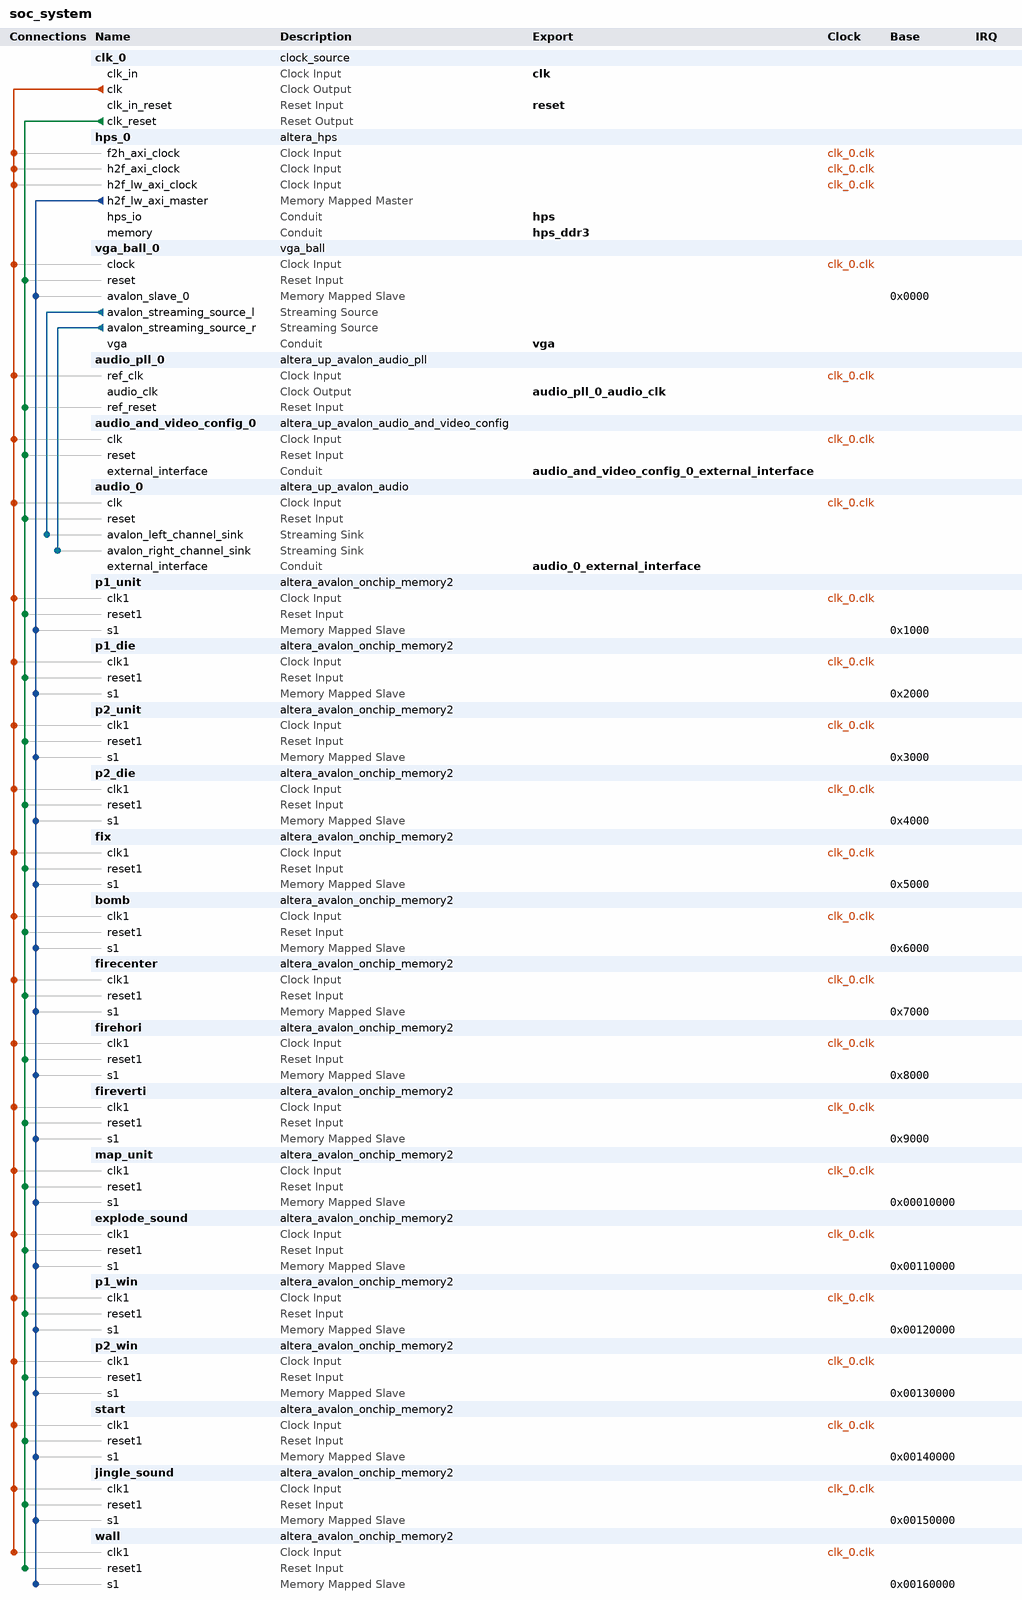
[diagram p0: system contents]
# Platform Designer (Qsys) system soc_system, Cyclone V 5CSEMA5F31C6
# Parameters at their usual value, and those the tool derives, are not listed.
package require -exact qsys 21.1
create_system soc_system
set_project_property DEVICE_FAMILY {Cyclone V}
set_project_property DEVICE 5CSEMA5F31C6

add_instance clk_0 clock_source 21.1
set_instance_parameter_value clk_0 clockFrequency 50000000

add_instance hps_0 altera_hps 21.1
set_instance_parameter_value hps_0 EMAC1_Mode RGMII
set_instance_parameter_value hps_0 EMAC1_PinMuxing {HPS I/O Set 0}
set_instance_parameter_value hps_0 F2SCLK_COLDRST_Enable false
set_instance_parameter_value hps_0 F2SCLK_DBGRST_Enable false
set_instance_parameter_value hps_0 F2SCLK_WARMRST_Enable false
set_instance_parameter_value hps_0 F2SINTERRUPT_Enable true
set_instance_parameter_value hps_0 F2S_Width 2
set_instance_parameter_value hps_0 FPGA_PERIPHERAL_OUTPUT_CLOCK_FREQ_EMAC0_GTX_CLK 125
set_instance_parameter_value hps_0 FPGA_PERIPHERAL_OUTPUT_CLOCK_FREQ_EMAC0_MD_CLK 2.5
set_instance_parameter_value hps_0 FPGA_PERIPHERAL_OUTPUT_CLOCK_FREQ_EMAC1_GTX_CLK 125
set_instance_parameter_value hps_0 FPGA_PERIPHERAL_OUTPUT_CLOCK_FREQ_EMAC1_MD_CLK 2.5
set_instance_parameter_value hps_0 HPS_PROTOCOL DDR3
set_instance_parameter_value hps_0 I2C0_Mode I2C
set_instance_parameter_value hps_0 I2C0_PinMuxing {HPS I/O Set 0}
set_instance_parameter_value hps_0 I2C1_Mode I2C
set_instance_parameter_value hps_0 I2C1_PinMuxing {HPS I/O Set 0}
set_instance_parameter_value hps_0 LWH2F_Enable true
set_instance_parameter_value hps_0 MEM_BANKADDR_WIDTH 3
set_instance_parameter_value hps_0 MEM_CLK_FREQ 400.0
set_instance_parameter_value hps_0 MEM_COL_ADDR_WIDTH 10
set_instance_parameter_value hps_0 MEM_DQ_WIDTH 32
set_instance_parameter_value hps_0 MEM_DRV_STR RZQ/7
set_instance_parameter_value hps_0 MEM_ROW_ADDR_WIDTH 15
set_instance_parameter_value hps_0 MEM_RTT_NOM RZQ/4
set_instance_parameter_value hps_0 MEM_RTT_WR RZQ/4
set_instance_parameter_value hps_0 MEM_TCL 11
set_instance_parameter_value hps_0 MEM_TFAW_NS 30.0
set_instance_parameter_value hps_0 MEM_TRAS_NS 35.0
set_instance_parameter_value hps_0 MEM_TRCD_NS 13.75
set_instance_parameter_value hps_0 MEM_TRFC_NS 260.0
set_instance_parameter_value hps_0 MEM_TRP_NS 13.75
set_instance_parameter_value hps_0 MEM_TRRD_NS 7.7
set_instance_parameter_value hps_0 MEM_VENDOR JEDEC
set_instance_parameter_value hps_0 MEM_WTCL 8
set_instance_parameter_value hps_0 QSPI_Mode N/A
set_instance_parameter_value hps_0 QSPI_PinMuxing Unused
set_instance_parameter_value hps_0 REF_CLK_FREQ 25.0
set_instance_parameter_value hps_0 S2FCLK_USER1CLK_Enable true
set_instance_parameter_value hps_0 S2FCLK_USER1CLK_FREQ 50.0
set_instance_parameter_value hps_0 S2FCLK_USER2CLK 5
set_instance_parameter_value hps_0 S2F_Width 2
set_instance_parameter_value hps_0 SDIO_Mode {4-bit Data}
set_instance_parameter_value hps_0 SDIO_PinMuxing {HPS I/O Set 0}
set_instance_parameter_value hps_0 SPIM1_Mode {Single Slave Select}
set_instance_parameter_value hps_0 SPIM1_PinMuxing {HPS I/O Set 0}
set_instance_parameter_value hps_0 STM_Enable false
set_instance_parameter_value hps_0 TIMING_BOARD_AC_SKEW 0.03
set_instance_parameter_value hps_0 TIMING_BOARD_AC_TO_CK_SKEW 0.0
set_instance_parameter_value hps_0 TIMING_BOARD_DQ_TO_DQS_SKEW 0.0
set_instance_parameter_value hps_0 TIMING_BOARD_MAX_CK_DELAY 0.03
set_instance_parameter_value hps_0 TIMING_BOARD_MAX_DQS_DELAY 0.02
set_instance_parameter_value hps_0 TIMING_BOARD_SKEW_BETWEEN_DQS 0.08
set_instance_parameter_value hps_0 TIMING_BOARD_SKEW_CKDQS_DIMM_MAX 0.16
set_instance_parameter_value hps_0 TIMING_BOARD_SKEW_CKDQS_DIMM_MIN 0.09
set_instance_parameter_value hps_0 TIMING_BOARD_SKEW_WITHIN_DQS 0.01
set_instance_parameter_value hps_0 TIMING_TDH 65
set_instance_parameter_value hps_0 TIMING_TDQSCK 255
set_instance_parameter_value hps_0 TIMING_TDQSQ 125
set_instance_parameter_value hps_0 TIMING_TDS 30
set_instance_parameter_value hps_0 TIMING_TIH 140
set_instance_parameter_value hps_0 TIMING_TIS 180
set_instance_parameter_value hps_0 TIMING_TQSH 0.4
set_instance_parameter_value hps_0 UART0_Mode {No Flow Control}
set_instance_parameter_value hps_0 UART0_PinMuxing {HPS I/O Set 0}
set_instance_parameter_value hps_0 USB1_Mode SDR
set_instance_parameter_value hps_0 USB1_PinMuxing {HPS I/O Set 0}
set_instance_parameter_value hps_0 desired_cfg_clk_mhz 50.0
set_instance_parameter_value hps_0 desired_qspi_clk_mhz 400.0

add_instance vga_ball_0 vga_ball 1.0

add_instance audio_pll_0 altera_up_avalon_audio_pll 18.0
set_instance_parameter_value audio_pll_0 gui_refclk 50.0

add_instance audio_and_video_config_0 altera_up_avalon_audio_and_video_config 18.0
set_instance_parameter_value audio_and_video_config_0 audio_in {Microphone to ADC}
set_instance_parameter_value audio_and_video_config_0 bit_length 16
set_instance_parameter_value audio_and_video_config_0 board DE1-SoC
set_instance_parameter_value audio_and_video_config_0 line_in_bypass true
set_instance_parameter_value audio_and_video_config_0 sampling_rate {48 kHz}

add_instance audio_0 altera_up_avalon_audio 18.0
set_instance_parameter_value audio_0 audio_in true
set_instance_parameter_value audio_0 avalon_bus_type Streaming
set_instance_parameter_value audio_0 dw 16

add_instance p1_unit altera_avalon_onchip_memory2 21.1
set_instance_parameter_value p1_unit dataWidth 16
set_instance_parameter_value p1_unit dualPort false
set_instance_parameter_value p1_unit initMemContent true
set_instance_parameter_value p1_unit initializationFileName /user/stud/fall23/ym3000/EE4840/project-hw/16bit_mif/p1.mif
set_instance_parameter_value p1_unit memorySize 2048
set_instance_parameter_value p1_unit useNonDefaultInitFile true
set_instance_parameter_value p1_unit writable false

add_instance p1_die altera_avalon_onchip_memory2 21.1
set_instance_parameter_value p1_die dataWidth 16
set_instance_parameter_value p1_die dualPort false
set_instance_parameter_value p1_die initMemContent true
set_instance_parameter_value p1_die initializationFileName /user/stud/fall23/ym3000/EE4840/project-hw/16bit_mif/p1die.mif
set_instance_parameter_value p1_die memorySize 512
set_instance_parameter_value p1_die useNonDefaultInitFile true
set_instance_parameter_value p1_die writable false

add_instance p2_unit altera_avalon_onchip_memory2 21.1
set_instance_parameter_value p2_unit dataWidth 16
set_instance_parameter_value p2_unit dualPort false
set_instance_parameter_value p2_unit initMemContent true
set_instance_parameter_value p2_unit initializationFileName /user/stud/fall23/ym3000/EE4840/project-hw/16bit_mif/p2.mif
set_instance_parameter_value p2_unit memorySize 2048
set_instance_parameter_value p2_unit useNonDefaultInitFile true
set_instance_parameter_value p2_unit writable false

add_instance p2_die altera_avalon_onchip_memory2 21.1
set_instance_parameter_value p2_die dataWidth 16
set_instance_parameter_value p2_die dualPort false
set_instance_parameter_value p2_die initMemContent true
set_instance_parameter_value p2_die initializationFileName /user/stud/fall23/ym3000/EE4840/project-hw/16bit_mif/p2die.mif
set_instance_parameter_value p2_die memorySize 512
set_instance_parameter_value p2_die useNonDefaultInitFile true
set_instance_parameter_value p2_die writable false

add_instance fix altera_avalon_onchip_memory2 21.1
set_instance_parameter_value fix dataWidth 16
set_instance_parameter_value fix dualPort false
set_instance_parameter_value fix initMemContent true
set_instance_parameter_value fix initializationFileName /user/stud/fall23/ym3000/EE4840/project-hw/16bit_mif/fix.mif
set_instance_parameter_value fix memorySize 512
set_instance_parameter_value fix useNonDefaultInitFile true
set_instance_parameter_value fix writable false

add_instance bomb altera_avalon_onchip_memory2 21.1
set_instance_parameter_value bomb dataWidth 16
set_instance_parameter_value bomb dualPort false
set_instance_parameter_value bomb initMemContent true
set_instance_parameter_value bomb initializationFileName /user/stud/fall23/ym3000/EE4840/project-hw/16bit_mif/bomb.mif
set_instance_parameter_value bomb memorySize 512
set_instance_parameter_value bomb useNonDefaultInitFile true
set_instance_parameter_value bomb writable false

add_instance firecenter altera_avalon_onchip_memory2 21.1
set_instance_parameter_value firecenter dataWidth 16
set_instance_parameter_value firecenter dualPort false
set_instance_parameter_value firecenter initMemContent true
set_instance_parameter_value firecenter initializationFileName /user/stud/fall23/ym3000/EE4840/project-hw/16bit_mif/firecenter.mif
set_instance_parameter_value firecenter memorySize 512
set_instance_parameter_value firecenter useNonDefaultInitFile true
set_instance_parameter_value firecenter writable false

add_instance firehori altera_avalon_onchip_memory2 21.1
set_instance_parameter_value firehori dataWidth 16
set_instance_parameter_value firehori dualPort false
set_instance_parameter_value firehori initMemContent true
set_instance_parameter_value firehori initializationFileName /user/stud/fall23/ym3000/EE4840/project-hw/16bit_mif/firehori.mif
set_instance_parameter_value firehori memorySize 512
set_instance_parameter_value firehori useNonDefaultInitFile true
set_instance_parameter_value firehori writable false

add_instance fireverti altera_avalon_onchip_memory2 21.1
set_instance_parameter_value fireverti dataWidth 16
set_instance_parameter_value fireverti dualPort false
set_instance_parameter_value fireverti initMemContent true
set_instance_parameter_value fireverti initializationFileName /user/stud/fall23/ym3000/EE4840/project-hw/16bit_mif/fireverti.mif
set_instance_parameter_value fireverti memorySize 512
set_instance_parameter_value fireverti useNonDefaultInitFile true
set_instance_parameter_value fireverti writable false

add_instance map_unit altera_avalon_onchip_memory2 21.1
set_instance_parameter_value map_unit dataWidth 8
set_instance_parameter_value map_unit dualPort false
set_instance_parameter_value map_unit initMemContent true
set_instance_parameter_value map_unit initializationFileName /user/stud/fall23/ym3000/EE4840/project-hw/16bit_mif/fix_map.mif
set_instance_parameter_value map_unit memorySize 1200
set_instance_parameter_value map_unit useNonDefaultInitFile true

add_instance explode_sound altera_avalon_onchip_memory2 21.1
set_instance_parameter_value explode_sound dataWidth 16
set_instance_parameter_value explode_sound dualPort false
set_instance_parameter_value explode_sound initMemContent true
set_instance_parameter_value explode_sound initializationFileName /user/stud/fall23/ym3000/EE4840/project-hw/mif/explode.mif
set_instance_parameter_value explode_sound memorySize 24218
set_instance_parameter_value explode_sound useNonDefaultInitFile true
set_instance_parameter_value explode_sound writable false

add_instance p1_win altera_avalon_onchip_memory2 21.1
set_instance_parameter_value p1_win dataWidth 16
set_instance_parameter_value p1_win dualPort false
set_instance_parameter_value p1_win initMemContent true
set_instance_parameter_value p1_win initializationFileName /user/stud/fall23/ym3000/EE4840/project-hw/16bit_mif/p1win.mif
set_instance_parameter_value p1_win memorySize 3072
set_instance_parameter_value p1_win useNonDefaultInitFile true
set_instance_parameter_value p1_win writable false

add_instance p2_win altera_avalon_onchip_memory2 21.1
set_instance_parameter_value p2_win dataWidth 16
set_instance_parameter_value p2_win dualPort false
set_instance_parameter_value p2_win initMemContent true
set_instance_parameter_value p2_win initializationFileName /user/stud/fall23/ym3000/EE4840/project-hw/16bit_mif/p2win.mif
set_instance_parameter_value p2_win memorySize 3072
set_instance_parameter_value p2_win useNonDefaultInitFile true
set_instance_parameter_value p2_win writable false

add_instance start altera_avalon_onchip_memory2 21.1
set_instance_parameter_value start dataWidth 16
set_instance_parameter_value start dualPort false
set_instance_parameter_value start initMemContent true
set_instance_parameter_value start initializationFileName /user/stud/fall23/ym3000/EE4840/project-hw/16bit_mif/start.mif
set_instance_parameter_value start memorySize 8192
set_instance_parameter_value start useNonDefaultInitFile true
set_instance_parameter_value start writable false

add_instance jingle_sound altera_avalon_onchip_memory2 21.1
set_instance_parameter_value jingle_sound dataWidth 16
set_instance_parameter_value jingle_sound dualPort false
set_instance_parameter_value jingle_sound initMemContent true
set_instance_parameter_value jingle_sound initializationFileName /user/stud/fall23/ym3000/EE4840/project-hw/mif/jingle.mif
set_instance_parameter_value jingle_sound memorySize 30336
set_instance_parameter_value jingle_sound useNonDefaultInitFile true
set_instance_parameter_value jingle_sound writable false

add_instance wall altera_avalon_onchip_memory2 21.1
set_instance_parameter_value wall dataWidth 16
set_instance_parameter_value wall dualPort false
set_instance_parameter_value wall initMemContent true
set_instance_parameter_value wall initializationFileName /user/stud/fall23/ym3000/EE4840/project-hw/16bit_mif/wall.mif
set_instance_parameter_value wall memorySize 512
set_instance_parameter_value wall useNonDefaultInitFile true
set_instance_parameter_value wall writable false

# connections
add_connection clk_0.clk audio_0.clk clock
add_connection clk_0.clk audio_and_video_config_0.clk clock
add_connection clk_0.clk audio_pll_0.ref_clk clock
add_connection clk_0.clk bomb.clk1 clock
add_connection clk_0.clk explode_sound.clk1 clock
add_connection clk_0.clk firecenter.clk1 clock
add_connection clk_0.clk firehori.clk1 clock
add_connection clk_0.clk fireverti.clk1 clock
add_connection clk_0.clk fix.clk1 clock
add_connection clk_0.clk hps_0.f2h_axi_clock clock
add_connection clk_0.clk hps_0.h2f_axi_clock clock
add_connection clk_0.clk hps_0.h2f_lw_axi_clock clock
add_connection clk_0.clk jingle_sound.clk1 clock
add_connection clk_0.clk map_unit.clk1 clock
add_connection clk_0.clk p1_die.clk1 clock
add_connection clk_0.clk p1_unit.clk1 clock
add_connection clk_0.clk p1_win.clk1 clock
add_connection clk_0.clk p2_die.clk1 clock
add_connection clk_0.clk p2_unit.clk1 clock
add_connection clk_0.clk p2_win.clk1 clock
add_connection clk_0.clk start.clk1 clock
add_connection clk_0.clk vga_ball_0.clock clock
add_connection clk_0.clk wall.clk1 clock
add_connection clk_0.clk_reset audio_0.reset reset
add_connection clk_0.clk_reset audio_and_video_config_0.reset reset
add_connection clk_0.clk_reset audio_pll_0.ref_reset reset
add_connection clk_0.clk_reset bomb.reset1 reset
add_connection clk_0.clk_reset explode_sound.reset1 reset
add_connection clk_0.clk_reset firecenter.reset1 reset
add_connection clk_0.clk_reset firehori.reset1 reset
add_connection clk_0.clk_reset fireverti.reset1 reset
add_connection clk_0.clk_reset fix.reset1 reset
add_connection clk_0.clk_reset jingle_sound.reset1 reset
add_connection clk_0.clk_reset map_unit.reset1 reset
add_connection clk_0.clk_reset p1_die.reset1 reset
add_connection clk_0.clk_reset p1_unit.reset1 reset
add_connection clk_0.clk_reset p1_win.reset1 reset
add_connection clk_0.clk_reset p2_die.reset1 reset
add_connection clk_0.clk_reset p2_unit.reset1 reset
add_connection clk_0.clk_reset p2_win.reset1 reset
add_connection clk_0.clk_reset start.reset1 reset
add_connection clk_0.clk_reset vga_ball_0.reset reset
add_connection clk_0.clk_reset wall.reset1 reset
add_connection hps_0.h2f_lw_axi_master bomb.s1 avalon
set_connection_parameter_value hps_0.h2f_lw_axi_master/bomb.s1 baseAddress 0x6000
add_connection hps_0.h2f_lw_axi_master explode_sound.s1 avalon
set_connection_parameter_value hps_0.h2f_lw_axi_master/explode_sound.s1 baseAddress 0x00110000
add_connection hps_0.h2f_lw_axi_master firecenter.s1 avalon
set_connection_parameter_value hps_0.h2f_lw_axi_master/firecenter.s1 baseAddress 0x7000
add_connection hps_0.h2f_lw_axi_master firehori.s1 avalon
set_connection_parameter_value hps_0.h2f_lw_axi_master/firehori.s1 baseAddress 0x8000
add_connection hps_0.h2f_lw_axi_master fireverti.s1 avalon
set_connection_parameter_value hps_0.h2f_lw_axi_master/fireverti.s1 baseAddress 0x9000
add_connection hps_0.h2f_lw_axi_master fix.s1 avalon
set_connection_parameter_value hps_0.h2f_lw_axi_master/fix.s1 baseAddress 0x5000
add_connection hps_0.h2f_lw_axi_master jingle_sound.s1 avalon
set_connection_parameter_value hps_0.h2f_lw_axi_master/jingle_sound.s1 baseAddress 0x00150000
add_connection hps_0.h2f_lw_axi_master map_unit.s1 avalon
set_connection_parameter_value hps_0.h2f_lw_axi_master/map_unit.s1 baseAddress 0x00010000
add_connection hps_0.h2f_lw_axi_master p1_die.s1 avalon
set_connection_parameter_value hps_0.h2f_lw_axi_master/p1_die.s1 baseAddress 0x2000
add_connection hps_0.h2f_lw_axi_master p1_unit.s1 avalon
set_connection_parameter_value hps_0.h2f_lw_axi_master/p1_unit.s1 baseAddress 0x1000
add_connection hps_0.h2f_lw_axi_master p1_win.s1 avalon
set_connection_parameter_value hps_0.h2f_lw_axi_master/p1_win.s1 baseAddress 0x00120000
add_connection hps_0.h2f_lw_axi_master p2_die.s1 avalon
set_connection_parameter_value hps_0.h2f_lw_axi_master/p2_die.s1 baseAddress 0x4000
add_connection hps_0.h2f_lw_axi_master p2_unit.s1 avalon
set_connection_parameter_value hps_0.h2f_lw_axi_master/p2_unit.s1 baseAddress 0x3000
add_connection hps_0.h2f_lw_axi_master p2_win.s1 avalon
set_connection_parameter_value hps_0.h2f_lw_axi_master/p2_win.s1 baseAddress 0x00130000
add_connection hps_0.h2f_lw_axi_master start.s1 avalon
set_connection_parameter_value hps_0.h2f_lw_axi_master/start.s1 baseAddress 0x00140000
add_connection hps_0.h2f_lw_axi_master vga_ball_0.avalon_slave_0 avalon
set_connection_parameter_value hps_0.h2f_lw_axi_master/vga_ball_0.avalon_slave_0 baseAddress 0x0000
add_connection hps_0.h2f_lw_axi_master wall.s1 avalon
set_connection_parameter_value hps_0.h2f_lw_axi_master/wall.s1 baseAddress 0x00160000
add_connection vga_ball_0.avalon_streaming_source_l audio_0.avalon_left_channel_sink avalon_streaming
add_connection vga_ball_0.avalon_streaming_source_r audio_0.avalon_right_channel_sink avalon_streaming

# exported interfaces
add_interface audio_0_external_interface conduit end
set_interface_property audio_0_external_interface EXPORT_OF audio_0.external_interface
add_interface audio_and_video_config_0_external_interface conduit end
set_interface_property audio_and_video_config_0_external_interface EXPORT_OF audio_and_video_config_0.external_interface
add_interface audio_pll_0_audio_clk clock source
set_interface_property audio_pll_0_audio_clk EXPORT_OF audio_pll_0.audio_clk
add_interface clk clock sink
set_interface_property clk EXPORT_OF clk_0.clk_in
add_interface hps conduit end
set_interface_property hps EXPORT_OF hps_0.hps_io
add_interface hps_ddr3 conduit end
set_interface_property hps_ddr3 EXPORT_OF hps_0.memory
add_interface reset reset sink
set_interface_property reset EXPORT_OF clk_0.clk_in_reset
add_interface vga conduit end
set_interface_property vga EXPORT_OF vga_ball_0.vga

set_interconnect_requirement {$system} qsys_mm.clockCrossingAdapter HANDSHAKE
set_interconnect_requirement {$system} qsys_mm.enableEccProtection FALSE
set_interconnect_requirement {$system} qsys_mm.insertDefaultSlave FALSE
set_interconnect_requirement {$system} qsys_mm.maxAdditionalLatency 1

save_system soc_system.qsys
